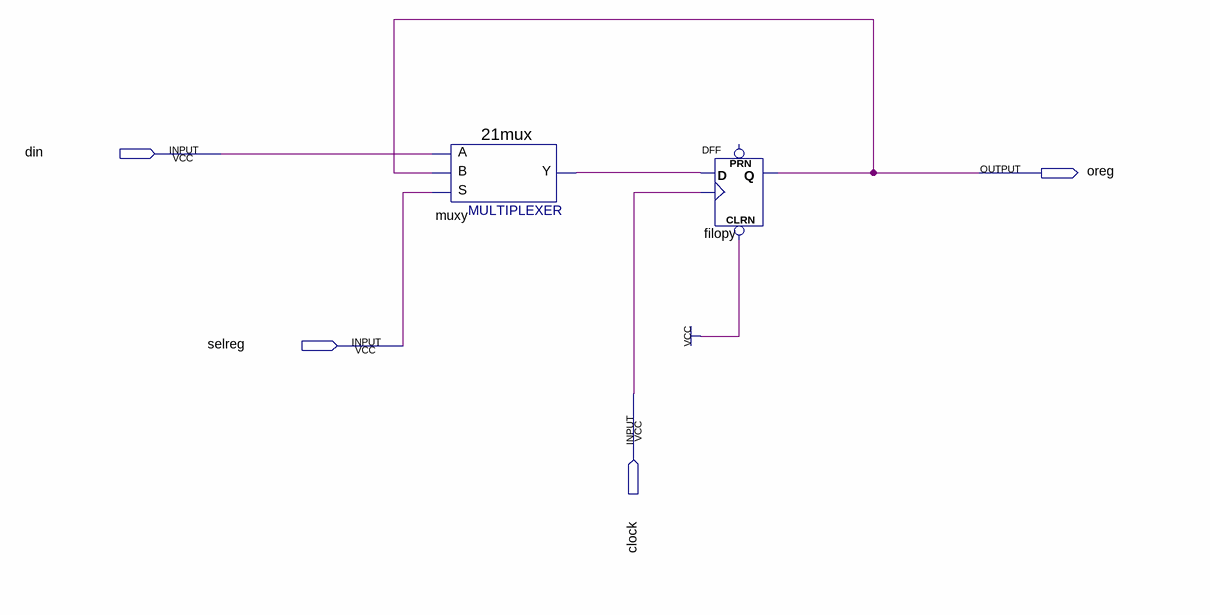
[diagram p0: schematic sheet]
// Quartus schematic test.bdf as structural Verilog: 2 symbols, 4 pins
module test (
  input  din,
  input  selreg,
  input  clock,
  output oreg
);

  wire muxy_y;

  \21mux  muxy (.S(selreg), .B(oreg), .A(din), .Y(muxy_y));
  DFF filopy (.CLRN(1'b1), .CLK(clock), .D(muxy_y), .Q(oreg));  // open: PRN
endmodule
